# EAGLE design MUX (EAGLE 9.1.2)
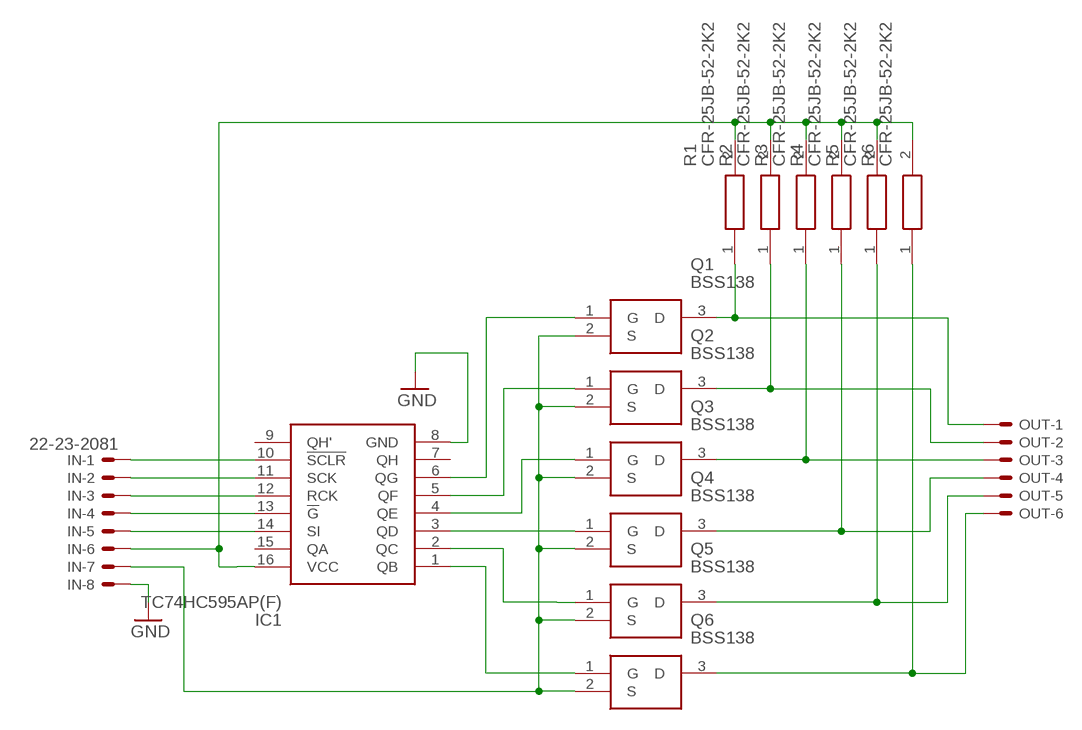
[diagram p0: schematic, sheet 1]

## Parts
IC1  TC74HC595AP(F)  [DIP762W60P254L1925H445Q16N]
IN  22-23-2081  [22-23-2081]
OUT  22-23-2061  [22-23-2061]
Q1  BSS138  [SOT95P240X120-3N]
Q2  BSS138  [SOT95P240X120-3N]
Q3  BSS138  [SOT95P240X120-3N]
Q4  BSS138  [SOT95P240X120-3N]
Q5  BSS138  [SOT95P240X120-3N]
Q6  BSS138  [SOT95P240X120-3N]
R1  CFR-25JB-52-2K2  [RESAD1590W60L630D240]
R2  CFR-25JB-52-2K2  [RESAD1590W60L630D240]
R3  CFR-25JB-52-2K2  [RESAD1590W60L630D240]
R4  CFR-25JB-52-2K2  [RESAD1590W60L630D240]
R5  CFR-25JB-52-2K2  [RESAD1590W60L630D240]
R6  CFR-25JB-52-2K2  [RESAD1590W60L630D240]

## Nets
GND: IC1.8(GND) IN.8
N$1: IN.7 Q1.2(S) Q2.2(S) Q3.2(S) Q4.2(S) Q5.2(S) Q6.2(S)
N$2: IC1.1(QB) Q6.1(G)
N$3: IC1.3(QD) Q4.1(G)
N$4: IC1.2(QC) Q5.1(G)
N$5: IC1.6(QG) Q1.1(G)
N$6: IC1.5(QF) Q2.1(G)
N$7: IC1.4(QE) Q3.1(G)
N$8: IC1.10(!SCLR) IN.1
N$9: IC1.11(SCK) IN.2
N$10: IC1.12(RCK) IN.3
N$11: IC1.13(!G) IN.4
N$12: IC1.14(SI) IN.5
N$13: IC1.16(VCC) IN.6 R1.2 R2.2 R3.2 R4.2 R5.2 R6.2
N$14: OUT.1 Q1.3(D) R1.1
N$15: OUT.2 Q2.3(D) R2.1
N$16: OUT.3 Q3.3(D) R3.1
N$17: OUT.4 Q4.3(D) R4.1
N$18: OUT.5 Q5.3(D) R5.1
N$19: OUT.6 Q6.3(D) R6.1
Unconnected: IC1.7(QH) IC1.9(QH') IC1.15(QA)

## Library data of the parts
IC1 = TC74HC595AP(F):TC74HC595AP(F): IC,CMOS logic,DIP16,SHIFT REGISTERS Source: Datasheet <http://toshiba.semicon-storage.com/info/docget.jsp?did=16512&prodName=TC74HC595AP>; DESCRIPTION: IC,CMOS logic,DIP16,SHIFT REGISTERS; HEIGHT: 4.45mm; MANUFACTURER_NAME: Toshiba; MANUFACTURER_PART_NUMBER: TC74HC595AP(F); MOUSER_PART_NUMBER: N/A; MOUSER_PRICE-STOCK: https://www.mouser.com/Search/Refine.aspx?Keyword=N%2FA; RS_PART_NUMBER: 5400095P; RS_PRICE-STOCK: http://au.rs-online.com/web/p/products/5400095P
IN = con-molex:22-23-2081: .100" (2.54mm) Center Header - 8 Pin; MF: MOLEX; MPN: 22-23-2081; OC_FARNELL: 1756826; OC_NEWARK: 01C7592
OUT = con-molex:22-23-2061: .100" (2.54mm) Center Header - 6 Pin; MF: MOLEX; MPN: 22-23-2061; OC_FARNELL: 1462922; OC_NEWARK: 27C1933
Q1-Q6 = BSS138:BSS138: N-channel MOSFET,BSS138 0.2A 50V Source: Datasheet <https://www.onsemi.com/pub/Collateral/BSS138-D.PDF>; DESCRIPTION: N-channel MOSFET,BSS138 0.2A 50V; HEIGHT: 1.2mm; MANUFACTURER_NAME: ON Semiconductor; MANUFACTURER_PART_NUMBER: BSS138; MOUSER_PART_NUMBER: 512-BSS138; RS_PART_NUMBER: 1241694; RS_PRICE-STOCK: http://uk.rs-online.com/web/p/products/1241694
R1-R6 = CFR-25JB-52-2K2:CFR-25JB-52-2K2: Carbon Film Resistors - Through Hole 1/4W 2.2K Ohm 5% Source: Datasheet <http://www.yageo.com/documents/recent/Yageo LR_CFR_2013.pdf>; DESCRIPTION: Carbon Film Resistors - Through Hole 1/4W 2.2K Ohm 5%; HEIGHT: mm; MANUFACTURER_NAME: YAGEO (PHYCOMP); MANUFACTURER_PART_NUMBER: CFR-25JB-52-2K2; MOUSER_PART_NUMBER: 603-CFR-25JB-52-2K2; MOUSER_PRICE-STOCK: https://www.mouser.com/Search/Refine.aspx?Keyword=603-CFR-25JB-52-2K2; RS_PART_NUMBER: 603-CFR-25JB-52-2K2; RS_PRICE-STOCK: https://www.mouser.com/Search/Refine.aspx?Keyword=603-CFR-25JB-52-2K2

## Board
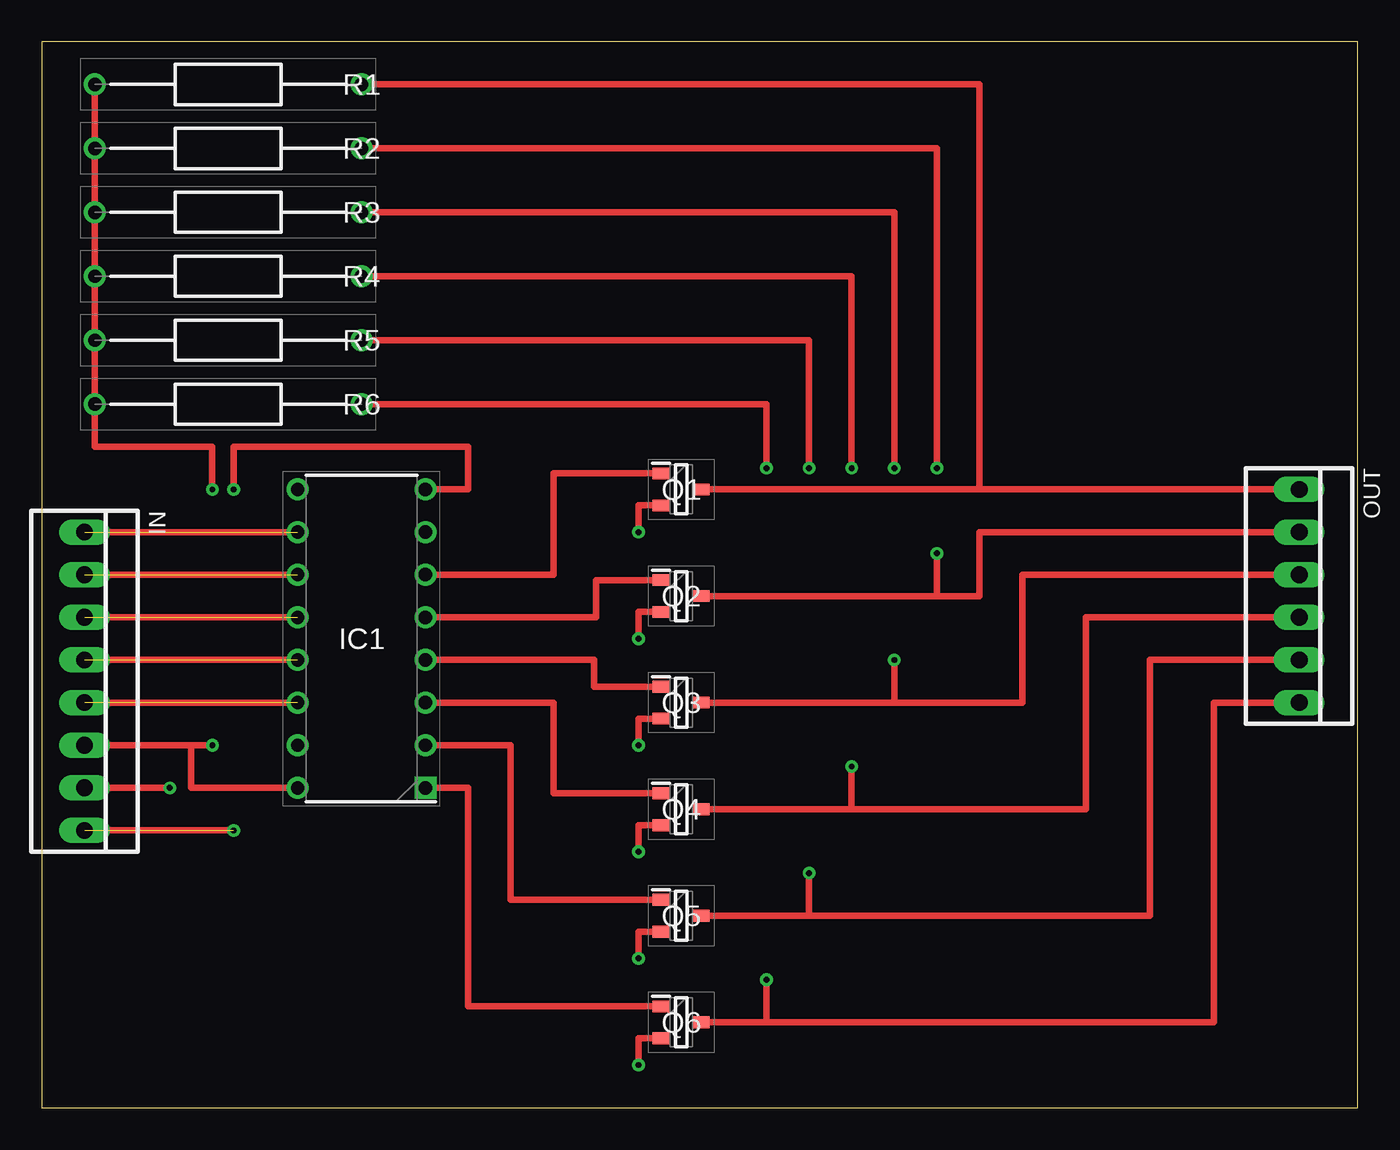
[diagram p1: board, top side]
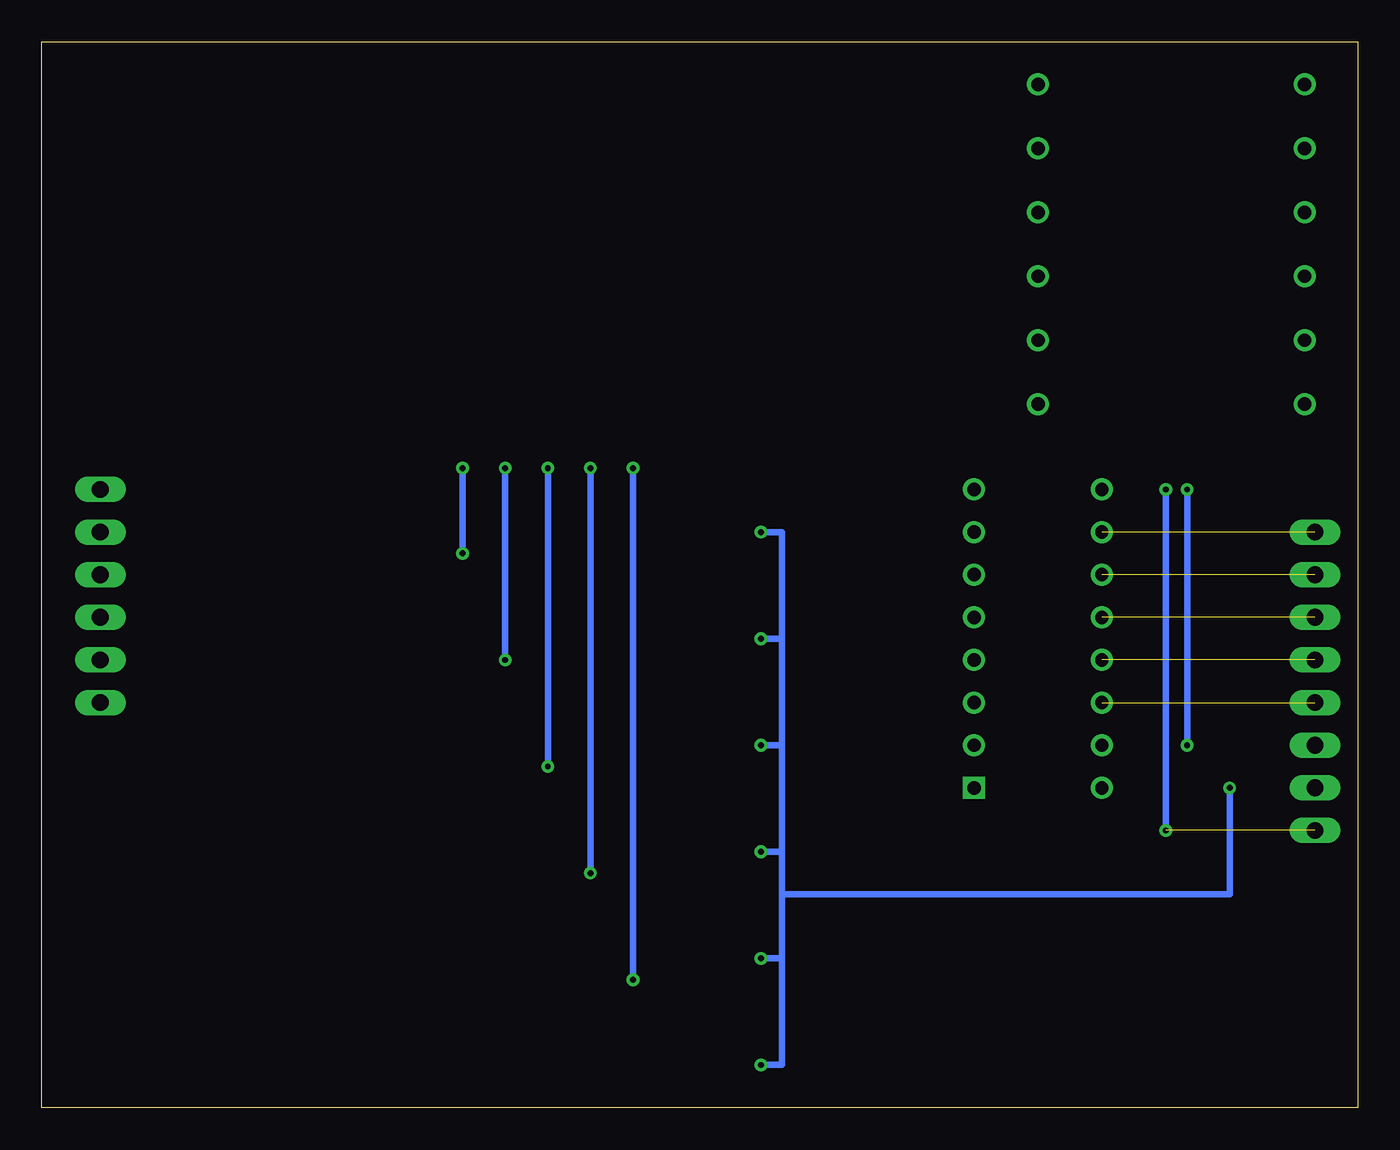
[diagram p2: board, bottom side, seen from below]

Size 78.41 x 63.49 mm. Coordinates in mm from the lower left corner, seen from the top.
Outline: 0,0 78.41,0 78.41,63.49 0,63.49 0,0
Copper layers (1*16): Top 0.035mm / dielectric 1.5mm / Bottom 0.035mm
Design rules "default": minimum track width 6mil, minimum drill 0.35mm, track to track 6mil, track to pad 6mil, pad to pad 6mil, via to via 6mil, smd to smd 6mil, copper to edge 40mil, drill to drill 6mil, minimum pad ring 10mil, minimum via ring 8mil, stop-mask expansion 4mil, vias tented up to drill 0mil, thermal gap 10mil

### Footprints (pad centres in the part's own frame; a part is rotated, then mirrored left to right if it is on the bottom)
DIP762W60P254L1925H445Q16N = drill 0.8 pad 1.2 square: 1 -3.81,8.89 | drill 0.8 pad 1.2: 2 -3.81,6.35; 3 -3.81,3.81; 4 -3.81,1.27; 5 -3.81,-1.27; 6 -3.81,-3.81; 7 -3.81,-6.35; 8 -3.81,-8.89; 9 3.81,-8.89; 10 3.81,-6.35; 11 3.81,-3.81; 12 3.81,-1.27; 13 3.81,1.27; 14 3.81,3.81; 15 3.81,6.35; 16 3.81,8.89
22-23-2081 = drill 1 long: 1 -8.89,0; 2 -6.35,0; 3 -3.81,0; 4 -1.27,0; 5 1.27,0; 6 3.81,0; 7 6.35,0; 8 8.89,0
22-23-2061 = drill 1 long: 1 -6.35,0; 2 -3.81,0; 3 -1.27,0; 4 1.27,0; 5 3.81,0; 6 6.35,0
SOT95P240X120-3N = smd 1 x 0.7: 1 -1.2,0.95; 2 -1.2,-0.95; 3 1.2,0
RESAD1590W60L630D240 = drill 0.8 pad 1.2: 1 0,0; 2 15.9,0

### Placement (x,y rotation side)
IC1  19.05,27.94 180 top
IN  2.54,25.4 270 top
OUT  74.93,30.48 270 top
Q1  38.1,36.83 0 top
Q2  38.1,30.48 0 top
Q3  38.1,24.13 0 top
Q4  38.1,17.78 0 top
Q5  38.1,11.43 0 top
Q6  38.1,5.08 0 top
R1  19.05,60.96 180 top
R2  19.05,57.15 180 top
R3  19.05,53.34 180 top
R4  19.05,49.53 180 top
R5  19.05,45.72 180 top
R6  19.05,41.91 180 top

### Tracks (layer width: path | path; a pad name or v marks a point on that pad's centre or on a via)
GND  (via drill 0.35)  (2 unrouted)
  Top 0.381: IN.8 v11.43,16.51 | v11.43,36.83 11.43,39.37 25.4,39.37 25.4,36.83 IC1.8
  Bottom 0.381: v11.43,16.51 v11.43,36.83
N$1  (via drill 0.35)
  Top 0.381: 36.51,10.48 Q5.2 35.56,10.48 v35.56,8.89 | IN.7 v7.62,19.05 | Q6.2 35.56,4.13 v35.56,2.54 | Q1.2 35.56,35.88 35.56,35.56 v35.56,34.29 | Q2.2 35.56,29.53 v35.56,27.94 | Q4.2 35.56,16.83 v35.56,15.24 | Q3.2 35.56,23.18 v35.56,21.59
  Bottom 0.381: v35.56,34.29 34.29,34.29 34.29,31.75 34.29,27.94 | 34.29,21.59 34.29,25.4 34.29,27.94 | 34.29,19.05 34.29,16.51 34.29,12.7 | 34.29,12.7 34.29,8.89 | v35.56,2.54 34.29,2.54 34.29,7.62 34.29,8.89 | v35.56,8.89 34.29,8.89 | v35.56,15.24 34.29,15.24 34.29,19.05 | v35.56,21.59 34.29,21.59 | v35.56,27.94 34.29,27.94 | 34.29,12.7 7.62,12.7 v7.62,19.05 | 34.29,21.59 34.29,19.05
N$2
  Top 0.381: IC1.1 25.4,19.05 25.4,17.78 25.4,6.03 Q6.1
N$3
  Top 0.381: Q4.1 30.48,18.73 30.48,24.13 IC1.3
N$4
  Top 0.381: IC1.2 27.94,21.59 27.94,12.38 Q5.1
N$5
  Top 0.381: IC1.6 30.48,31.75 30.48,37.78 Q1.1
N$6
  Top 0.381: IC1.5 33.02,29.21 33.02,31.43 Q2.1
N$7
  Top 0.381: IC1.4 32.9,26.67 32.9,25.08 Q3.1
N$8  (2 unrouted)
  Top 0.381: IN.1 IC1.10
N$9  (2 unrouted)
  Top 0.381: IN.2 IC1.11
N$10  (2 unrouted)
  Top 0.381: IN.3 IC1.12
N$11  (2 unrouted)
  Top 0.381: IN.4 IC1.13
N$12  (2 unrouted)
  Top 0.381: IN.5 IC1.14
N$13  (via drill 0.35)
  Top 0.381: IN.6 7.62,21.59 8.89,21.59 | 8.89,21.59 8.89,19.05 IC1.16 | 8.89,21.59 v10.16,21.59 | R1.2 R2.2 R3.2 R4.2 R5.2 R6.2 3.15,39.37 10.16,39.37 v10.16,36.83
  Bottom 0.381: v10.16,21.59 v10.16,36.83
N$14
  Top 0.381: R1.1 55.88,60.96 55.88,36.83 | 55.88,36.83 58.42,36.83 OUT.1 | 55.88,36.83 Q1.3
N$15  (via drill 0.35)
  Top 0.381: R2.1 53.34,57.15 v53.34,38.1 | Q2.3 53.34,30.48 | 53.34,30.48 55.88,30.48 55.88,34.29 OUT.2 | v53.34,33.02 53.34,30.48
  Bottom 0.381: v53.34,38.1 v53.34,33.02
N$16  (via drill 0.35)
  Top 0.381: R3.1 50.8,53.34 v50.8,38.1 | Q3.3 50.8,24.13 | 50.8,24.13 53.34,24.13 58.42,24.13 58.42,31.75 OUT.3 | v50.8,26.67 50.8,24.13
  Bottom 0.381: v50.8,38.1 v50.8,26.67
N$17  (via drill 0.35)
  Top 0.381: R4.1 48.26,49.53 v48.26,38.1 | Q4.3 48.26,17.78 | 48.26,17.78 50.8,17.78 62.23,17.78 62.23,29.21 OUT.4 | v48.26,20.32 48.26,17.78
  Bottom 0.381: v48.26,38.1 v48.26,20.32
N$18  (via drill 0.35)
  Top 0.381: R5.1 45.72,45.72 v45.72,38.1 | Q5.3 45.72,11.43 | 45.72,11.43 48.26,11.43 66.04,11.43 66.04,26.67 OUT.5 | v45.72,13.97 45.72,11.43
  Bottom 0.381: v45.72,38.1 v45.72,13.97
N$19  (via drill 0.35)
  Top 0.381: R6.1 43.18,41.91 v43.18,38.1 | Q6.3 43.18,5.08 | 43.18,5.08 44.45,5.08 45.72,5.08 69.85,5.08 69.85,24.13 OUT.6 | v43.18,7.62 43.18,5.08
  Bottom 0.381: v43.18,38.1 v43.18,7.62